# Altium project Đo Điện.PrjPcb
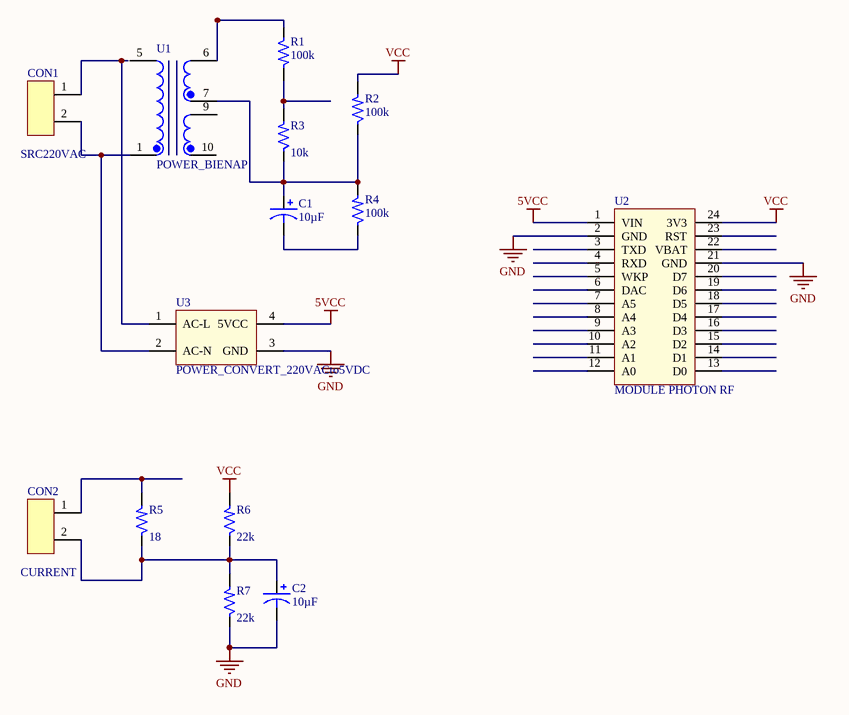
[diagram p0: Schematic.SchDoc]
1 sheet, 14 parts. Net scope: global (net labels, ports and power ports of the same name join across sheets).

## Sheet Schematic.SchDoc
size A3; CompanyName: FPT-FTI copporation; Address1: FPT Building Duy Tan; Address2: Floor 4,; NameAuthor: Angle Vu

### Parts
C1  Capacitance: 10µF  (hidden comment: C_10uF_HOLE_ALUM_25V)
C2  Capacitance: 10µF  (hidden comment: C_10uF_HOLE_ALUM_25V)
CON1  SRC220VAC
CON2  CURRENT
R1  Resistance (Ohms): 100k  [R_HOLE_0.25W_0.4]  (hidden comment: R_100k_HOLE_0.1%_1W)
R2  Resistance (Ohms): 100k  [R_HOLE_0.25W_0.4]  (hidden comment: R_100k_HOLE_0.1%_1W)
R3  Resistance (Ohms): 10k  [R_HOLE_0.25W_0.4]  (hidden comment: R_10K_HOLE_1%_1W)
R4  Resistance (Ohms): 100k  [R_HOLE_0.25W_0.4]  (hidden comment: R_100k_HOLE_0.1%_1W)
R5  Resistance (Ohms): 18  [R_HOLE_0.25W_0.4]  (hidden comment: R_18_HOLE_1%_1W)
R6  Resistance (Ohms): 22k  [R_HOLE_0.25W_0.4]  (hidden comment: R_22K_HOLE_1%_1/4W)
R7  Resistance (Ohms): 22k  [R_HOLE_0.25W_0.4]  (hidden comment: R_22K_HOLE_1%_1/4W)
U1  POWER_BIENAP  [POWER_BIEN_AP]
U2  MODULE PHOTON RF  [MODULE PHOTON RF]
U3  POWER_CONVERT_220VACto5VDC  [POWER_CONVERT220VACto5VDC]

### Nets
5VCC: U2.1(VIN) U3.4(5VCC)
GND: C2.2 R7.1 U2.2(GND) U2.21(GND) U3.3(GND)
VCC: R2.2 R6.2 U2.24(3V3)
NetC1_1: C1.1 R2.1 R3.1 R4.2 U1.7
NetC1_2: C1.2 R4.1
NetC2_1: C2.1 R5.1 R6.1 R7.2
NetR1_1: R1.1 U1.6
NetR1_2: R1.2 R3.2
NetU1_1: U1.1 U3.2(AC-N)

Not connected (* = marked no-connect by the designer): CON1 1(SIGN+) 2(SIGN-); CON2 1(SIGN+) 2(SIGN-); R5 2; U1 5 9 10; U2 3(TXD) 4(RXD) 5(WKP) 6(DAC) 7(A5) 8(A4) 9(A3) 10(A2) 11(A1) 12(A0) 13(D0) 14(D1) 15(D2) 16(D3) 17(D4) 18(D5) 19(D6) 20(D7) 22(VBAT) 23(RST); U3 1(AC-L)

### Notes on the sheet
- Designed By
- Checked By
- Company:
- Size:
- A3
- Address:
- Sheet:
- /

### Library data of the parts
C1 C2 = C_10uF_HOLE_ALUM_25V: CAP ALUM 10uF 20% 25V; Manufacturer: Panasonic Electronic Components; Manufacturer Part Number: ECE-A1EN100U; Lifetime @ Temp.: 2000 Hrs @ 85°C; Polarization: Bi-Polar; Ripple Current: 45mA @ 120Hz; Supplier 1: Digi-Key; RoHS: RoHS Compliant; Category: Capacitors; Stock 1: 52823; Pricing 1: 1=0.3, 10=0.211, 25=0.1732, 50=0.1478, 100=0.1266, 250=0.10552, 500=0.09496, 1000=0.08018, 2500=0.07596 (USD); Packaging: Bulk; Part Status: Active; Tolerance: ±20%; Voltage Rating: 25V; ESR (Equivalent Series Resistance): -; Operating Temperature: -40°C ~ 85°C; Applications: General Purpose; Impedance: -; Lead Spacing: 0.079" (2.00mm); Size / Dimension: 0.197" Dia (5.00mm); Height - Seated (Max): 0.433" (11.00mm); Surface Mount Land Size: -; Mounting Type: Through Hole; Package / Case: Radial, Can; ComponentLink1URL: http://industrial.panasonic.com/www-cgi/jvcr13pz.cgi?E+PZ+3+ABA0097+ECEA1EN100U+7+WW; ComponentLink1Description: http://industrial.panasonic.com/www-cgi/jvcr13pz.cgi?E+PZ+3+ABA0097+ECEA1EN100U+7+WW; Supplier Part Number 1: P1176-ND
CON1 CON2 = CON_HEADER_MALE_PIN2: TERM BLOCK HDR 2POS R/A 5.08MM; Manufacturer: TE Connectivity AMP Connectors; Manufacturer Part Number: 282815-2; Number of Positions: 2; Number of Levels: 1; Pitch: 0.200" (5.08mm); Header Orientation: 90°, Right Angle; Current - UL: 15A; Voltage - UL: 300V; Supplier 1: Digi-Key; RoHS: RoHS Compliant; Category: Connectors, Interconnects; Stock 1: 1454; Pricing 1: 1=0.98, 10=0.609, 25=0.5212, 50=0.4686, 100=0.4588, 250=0.39052, 500=0.37098, 1000=0.33193, 2500=0.26359 (USD); Packaging: Bulk; Part Status: Active; Type: Header, Male Pins, Shrouded (2 Side); Positions Per Level: 2; Plug Wire Entry: -; Termination Style: Solder; Mounting Type: Through Hole; Current - IEC: -; Voltage - IEC: -; Wire Gauge or Range - AWG: -; Wire Gauge or Range - mm²: -; Color: Green; Operating Temperature: -40°C ~ 110°C; Contact Mating Finish: Tin; Features: Side Stacking; ComponentLink1URL: http://www.te.com/commerce/DocumentDelivery/DDEController?Action=srchrtrv&DocNm=282815&DocType=Customer+Drawing&DocLang=English; ComponentLink1Description: http://www.te.com/commerce/DocumentDelivery/DDEController?Action=srchrtrv&DocNm=282815&DocType=Customer+Drawing&DocLang=English; Supplier Part Number 1: A113298-ND
R1 R2 R4 = R_100k_HOLE_0.1%_1W: RESISTOR METAL FILM 1W 100K OHM; Manufacturer: Vishay Dale; Manufacturer Part Number: CPF1100K00BHEE6; Tolerance: ±0.1%; Temperature Coefficient: ±50ppm/°C; Supplier 1: Digi-Key; RoHS: RoHS Compliant; Category: Resistors; Stock 1: 2000; Pricing 1: 1000=0.25781, 2000=0.24938, 5000=0.24375, 10000=0.23531, 25000=0.22969, 50000=0.22838 (USD); Packaging: Tape & Reel (TR); Part Status: Active; Power (Watts): 1W; Composition: Metal Film; Features: Flame Proof, Moisture Resistant, Safety; Operating Temperature: -65°C ~ 230°C; Package / Case: Axial; Supplier Device Package: Axial; Size / Dimension: 0.090" Dia x 0.240" L (2.29mm x 6.10mm); Height: -; Number of Terminations: 2; Failure Rate: -; ComponentLink1URL: http://www.vishay.com/docs/31021/cpf.pdf; ComponentLink1Description: http://www.vishay.com/docs/31021/cpf.pdf; Supplier Part Number 1: CPF100KATR-ND
R3 = R_10K_HOLE_1%_1W: RES 10.0K OHM 1W 1% AXIAL; Manufacturer: Vishay Dale; Manufacturer Part Number: CMF6010K000FKEB; Temperature Coefficient: ±100ppm/°C; Supplier 1: Digi-Key; RoHS: RoHS Compliant; Category: Resistors; Stock 1: 6000; Pricing 1: 1000=0.096, 2000=0.09, 5000=0.081, 10000=0.0792, 25000=0.0765, 50000=0.075, 100000=0.07428 (USD); Packaging: Tape & Reel (TR); Part Status: Active; Tolerance: ±1%; Power (Watts): 1W; Composition: Metal Film; Features: Flame Retardant Coating, Moisture Resistant, Safety; Operating Temperature: -55°C ~ 175°C; Package / Case: Axial; Supplier Device Package: Axial; Size / Dimension: 0.145" Dia x 0.344" L (3.68mm x 8.74mm); Height: -; Number of Terminations: 2; Failure Rate: -; ComponentLink1URL: http://www.vishay.com/docs/31018/cmfind.pdf; ComponentLink1Description: http://www.vishay.com/docs/31018/cmfind.pdf; Supplier Part Number 1: CMF10.0KFGTR-ND
R5 = R_18_HOLE_1%_1W: RES 18 OHM 1W 1% AXIAL; Manufacturer: Vishay Dale; Manufacturer Part Number: ALSR0118R00FE12; Temperature Coefficient: ±30ppm/°C; Supplier 1: Digi-Key; RoHS: RoHS Compliant; Category: Resistors; Stock 1: 157; Pricing 1: 1=1.95, 10=1.733, 50=1.512, 100=1.323, 250=1.134, 500=0.945, 1000=0.819 (USD); Packaging: Bulk; Part Status: Active; Tolerance: ±1%; Power (Watts): 1W; Composition: Wirewound; Features: Moisture Resistant; Operating Temperature: -65°C ~ 250°C; Package / Case: Axial; Supplier Device Package: Axial; Size / Dimension: 0.110" Dia x 0.406" L (2.79mm x 10.31mm); Height: -; Number of Terminations: 2; Failure Rate: -; ComponentLink1URL: http://www.vishay.com/docs/31800/alsralvr.pdf; ComponentLink1Description: http://www.vishay.com/docs/31800/alsralvr.pdf; Supplier Part Number 1: ALSR1F-18-ND
R6 R7 = R_22K_HOLE_1%_1/4W: RES 22K OHM 1/4W 1% AXIAL; Manufacturer: Stackpole Electronics Inc.; Manufacturer Part Number: RNMF14FTC22K0; Power (Watts): 0.25W, 1/4W; Temperature Coefficient: ±50ppm/°C; Supplier 1: Digi-Key; RoHS: RoHS Compliant; Category: Resistors; Stock 1: 45000; Pricing 1: 5000=0.00855, 10000=0.00743, 25000=0.00653, 50000=0.00599, 125000=0.00586 (USD); Packaging: Tape & Reel (TR); Part Status: Active; Tolerance: ±1%; Composition: Metal Film; Features: Flame Retardant Coating, Safety; Operating Temperature: -55°C ~ 155°C; Package / Case: Axial; Supplier Device Package: Axial; Size / Dimension: 0.070" Dia x 0.130" L (1.78mm x 3.30mm); Height: -; Number of Terminations: 2; Failure Rate: -; ComponentLink1URL: http://www.seielect.com/Catalog/SEI-RNF_RNMF.pdf; ComponentLink1Description: http://www.seielect.com/Catalog/SEI-RNF_RNMF.pdf; Supplier Part Number 1: S22KCATR-ND
U2 = MODULE PHOTON RF: PARTICLE PHOTON; Manufacturer: Seeed Technology Co., Ltd; Manufacturer Part Number: 114990286; Frequency: 2.4GHz; For Use With/Related Products: BCM43362, STM32F205; Supplied Contents: Board; Supplier 1: Digi-Key; RoHS: RoHS Compliant; Category: RF/IF and RFID; Stock 1: 82; Pricing 1: 1=20.19 (USD); Part Status: Active; Type: Transceiver; 802.11 b/g/n (Wi-Fi, WiFi, WLAN); ComponentLink1URL: https://docs.particle.io/datasheets/photon-datasheet/; ComponentLink1Description: https://docs.particle.io/datasheets/photon-datasheet/; Supplier Part Number 1: 1597-1150-ND